# EAGLE design LIC_rack_BB-00 (EAGLE 7.2.0)
AUTHOR: M. Petrilak; VERSION: 00

## Sheet 1 of 4
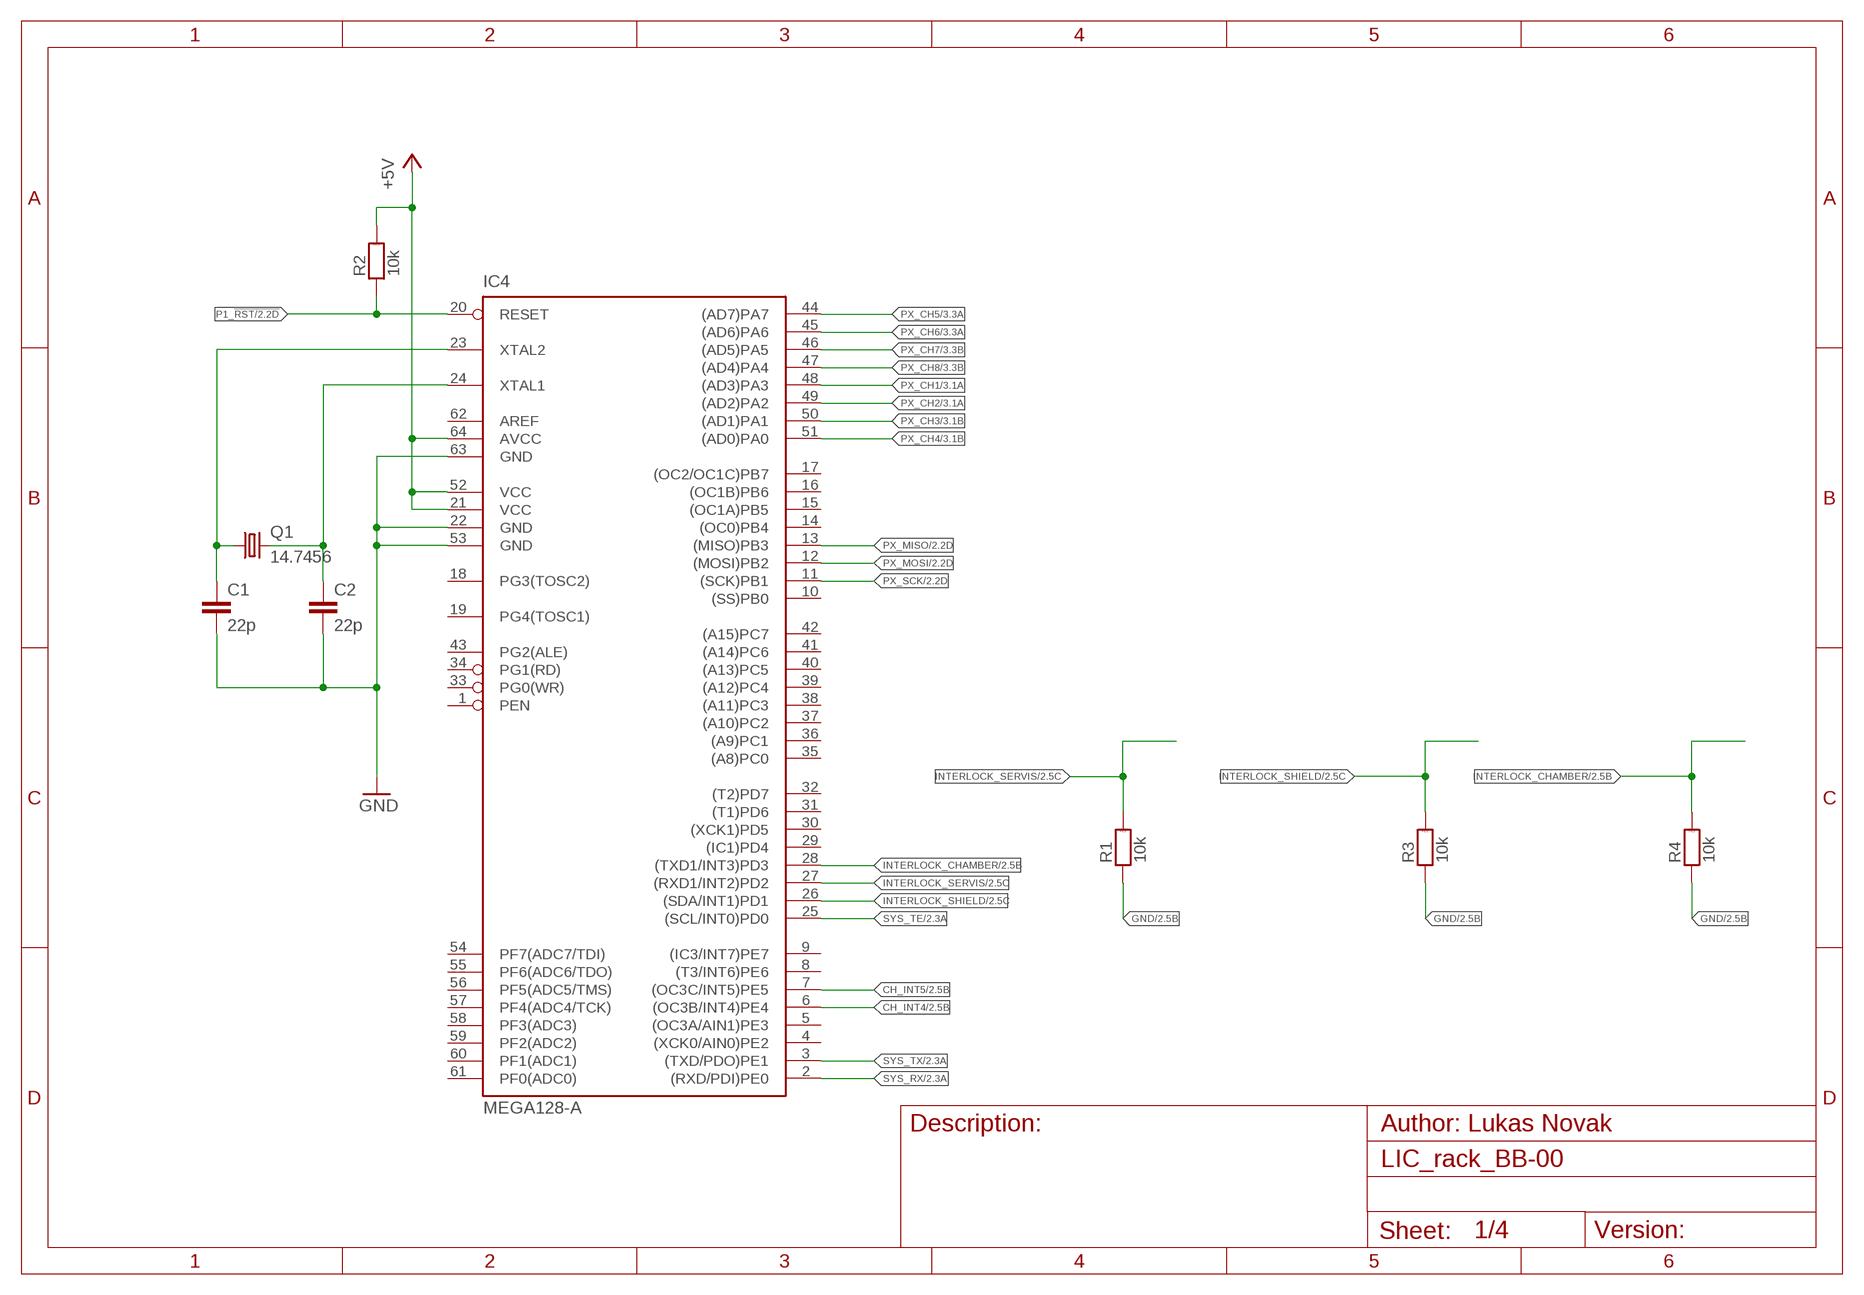
[diagram p0: schematic, sheet 1]

### Parts
C1  22p  C-EUC0805  [C0805]
C2  22p  C-EUC0805  [C0805]
IC4  MEGA128-A  [TQFP64]
Q1  14.7456  XTAL  [HC49U70]
R1  10k  R_1206  [1206]
R2  10k  R_1206  [1206]
R3  10k  R_1206  [1206]
R4  10k  R_1206  [1206]

### Nets
+5V: IC4.21(VCC) IC4.52(VCC) IC4.64(AVCC) R2.2 ; also sheet 2,3,4
CH_INT4: IC4.6((OC3B/INT4)PE4) ; also sheet 2,3
CH_INT5: IC4.7((OC3C/INT5)PE5) ; also sheet 2
CLK1: C1.1 IC4.23(XTAL2) Q1.1
GND: C1.2 C2.2 IC4.22(GND) IC4.53(GND) IC4.63(GND) R1.1 R3.1 R4.1 ; also sheet 2,3,4
INTERLOCK_CHAMBER: IC4.28((TXD1/INT3)PD3) R4.2 ; also sheet 2,3
INTERLOCK_SERVIS: IC4.27((RXD1/INT2)PD2) R1.2 ; also sheet 2
INTERLOCK_SHIELD: IC4.26((SDA/INT1)PD1) R3.2 ; also sheet 2
N$5: C2.1 IC4.24(XTAL1) Q1.2
P1_!RST: IC4.20(RESET) R2.1 ; also sheet 2
PX_CH1: IC4.48((AD3)PA3) ; also sheet 3
PX_CH2: IC4.49((AD2)PA2) ; also sheet 3
PX_CH3: IC4.50((AD1)PA1) ; also sheet 3
PX_CH4: IC4.51((AD0)PA0) ; also sheet 3
PX_CH5: IC4.44((AD7)PA7) ; also sheet 2,3
PX_CH6: IC4.45((AD6)PA6) ; also sheet 3
PX_CH7: IC4.46((AD5)PA5) ; also sheet 3
PX_CH8: IC4.47((AD4)PA4) ; also sheet 3
PX_MISO: IC4.13((MISO)PB3) ; also sheet 2
PX_MOSI: IC4.12((MOSI)PB2) ; also sheet 2
PX_SCK: IC4.11((SCK)PB1) ; also sheet 2
SYS_RX: IC4.2((RXD/PDI)PE0) ; also sheet 2
SYS_TE: IC4.25((SCL/INT0)PD0) ; also sheet 2
SYS_TX: IC4.3((TXD/PDO)PE1) ; also sheet 2
Unconnected: IC4.1(PEN) IC4.4((XCK0/AIN0)PE2) IC4.5((OC3A/AIN1)PE3) IC4.8((T3/INT6)PE6) IC4.9((IC3/INT7)PE7) IC4.10((SS)PB0) IC4.14((OC0)PB4) IC4.15((OC1A)PB5) IC4.16((OC1B)PB6) IC4.17((OC2/OC1C)PB7) IC4.18(PG3(TOSC2)) IC4.19(PG4(TOSC1)) IC4.29((IC1)PD4) IC4.30((XCK1)PD5) IC4.31((T1)PD6) IC4.32((T2)PD7) IC4.33(PG0(WR)) IC4.34(PG1(RD)) IC4.35((A8)PC0) IC4.36((A9)PC1) IC4.37((A10)PC2) IC4.38((A11)PC3) IC4.39((A12)PC4) IC4.40((A13)PC5) IC4.41((A14)PC6) IC4.42((A15)PC7) IC4.43(PG2(ALE)) IC4.54(PF7(ADC7/TDI)) IC4.55(PF6(ADC6/TDO)) IC4.56(PF5(ADC5/TMS)) IC4.57(PF4(ADC4/TCK)) IC4.58(PF3(ADC3)) IC4.59(PF2(ADC2)) IC4.60(PF1(ADC1)) IC4.61(PF0(ADC0)) IC4.62(AREF)

## Sheet 2 of 4
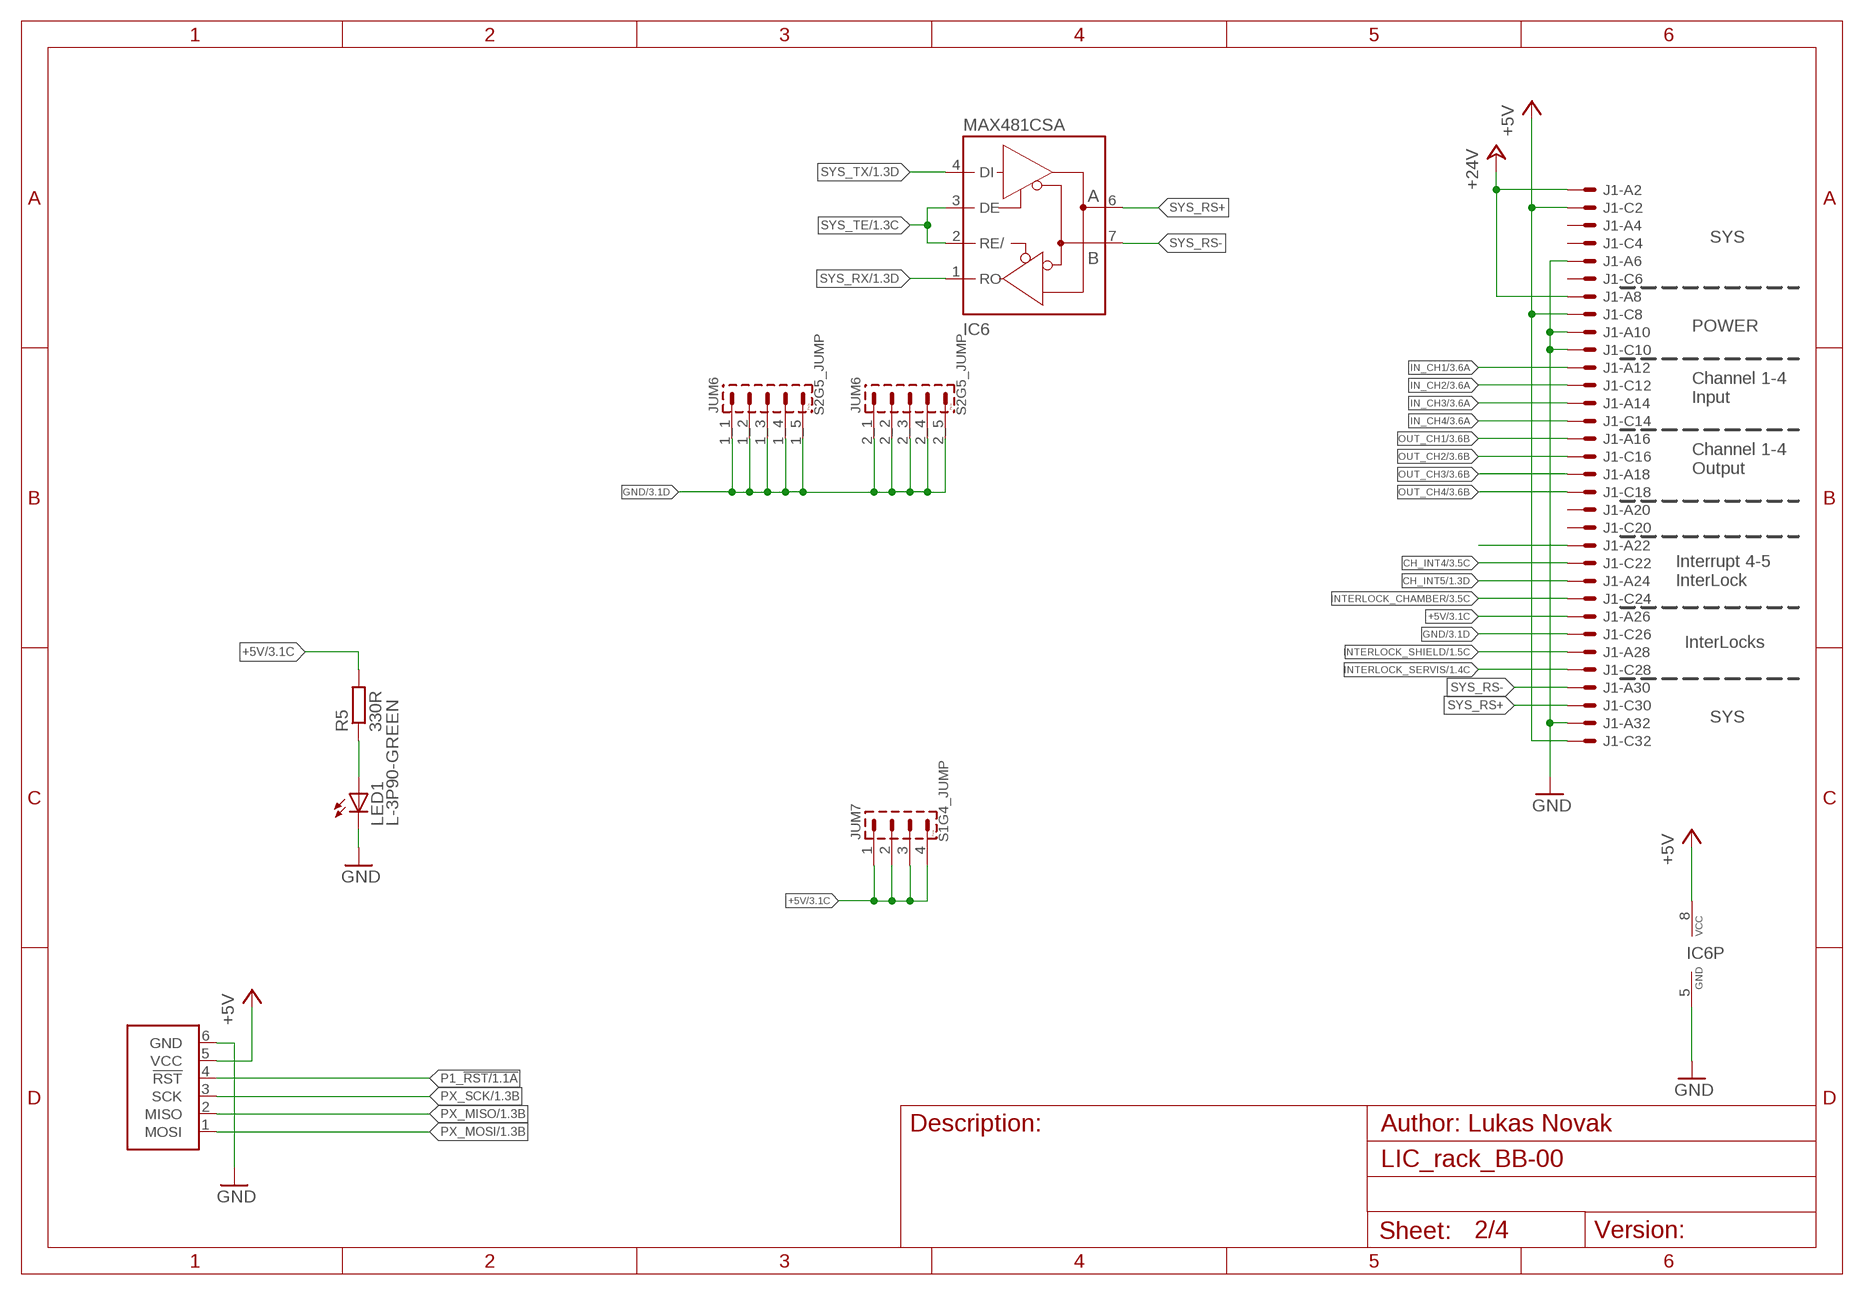
[diagram p1: schematic, sheet 2]

### Parts
IC6  MAX481CSA  [SO08]
J1  VG32SP  [VG32P]
JUM6  S2G5_JUMP  [S2G5_JUM]
JUM7  S1G4_JUMP  [S1G4_JUM]
LED1  L-3P90-GREEN  [L-3P90]
R5  330R  R-EU_R1206  [R1206]
U1  ATPROG-V  [6410-06]

### Nets
+5V: IC6.8(VCC) J1.A26 J1.C2 J1.C8 J1.C32 JUM7.1 JUM7.2 JUM7.3 JUM7.4 R5.2 U1.5(VCC) ; also sheet 1,3,4
+24V: J1.A2 J1.A8
CH_INT4: J1.C22 ; also sheet 1,3
CH_INT5: J1.A24 ; also sheet 1
GND: IC6.5(GND) J1.A6 J1.A10 J1.A32 J1.C10 J1.C26 JUM6.1_1 JUM6.1_2 JUM6.1_3 JUM6.1_4 JUM6.1_5 JUM6.2_1 JUM6.2_2 JUM6.2_3 JUM6.2_4 JUM6.2_5 LED1.K(C) U1.6(GND) ; also sheet 1,3,4
IN_CH1: J1.A12 ; also sheet 3
IN_CH2: J1.C12 ; also sheet 3
IN_CH3: J1.A14 ; also sheet 3
IN_CH4: J1.C14 ; also sheet 3
INTERLOCK_CHAMBER: J1.C24 ; also sheet 1,3
INTERLOCK_SERVIS: J1.C28 ; also sheet 1
INTERLOCK_SHIELD: J1.A28 ; also sheet 1
N$2: LED1.A R5.1
OUT_CH1: J1.A16 ; also sheet 3
OUT_CH2: J1.C16 ; also sheet 3
OUT_CH3: J1.A18 ; also sheet 3
OUT_CH4: J1.C18 ; also sheet 3
P1_!RST: U1.4(!RST) ; also sheet 1
PX_CH5: J1.A22 ; also sheet 1,3
PX_MISO: U1.2(MISO) ; also sheet 1
PX_MOSI: U1.1(MOSI) ; also sheet 1
PX_SCK: U1.3(SCK) ; also sheet 1
SYS_RS+: IC6.6(A) J1.C30
SYS_RS-: IC6.7(B) J1.A30
SYS_RX: IC6.1(RO) ; also sheet 1
SYS_TE: IC6.2(RE/) IC6.3(DE) ; also sheet 1
SYS_TX: IC6.4(DI) ; also sheet 1
Unconnected: J1.A4 J1.A20 J1.C4 J1.C6 J1.C20

### Notes on the sheet
- SYS
- POWER
- Channel 1-4
  Input
- Channel 1-4
  Output
- Interrupt 4-5
  InterLock
- InterLocks
- SYS

## Sheet 3 of 4
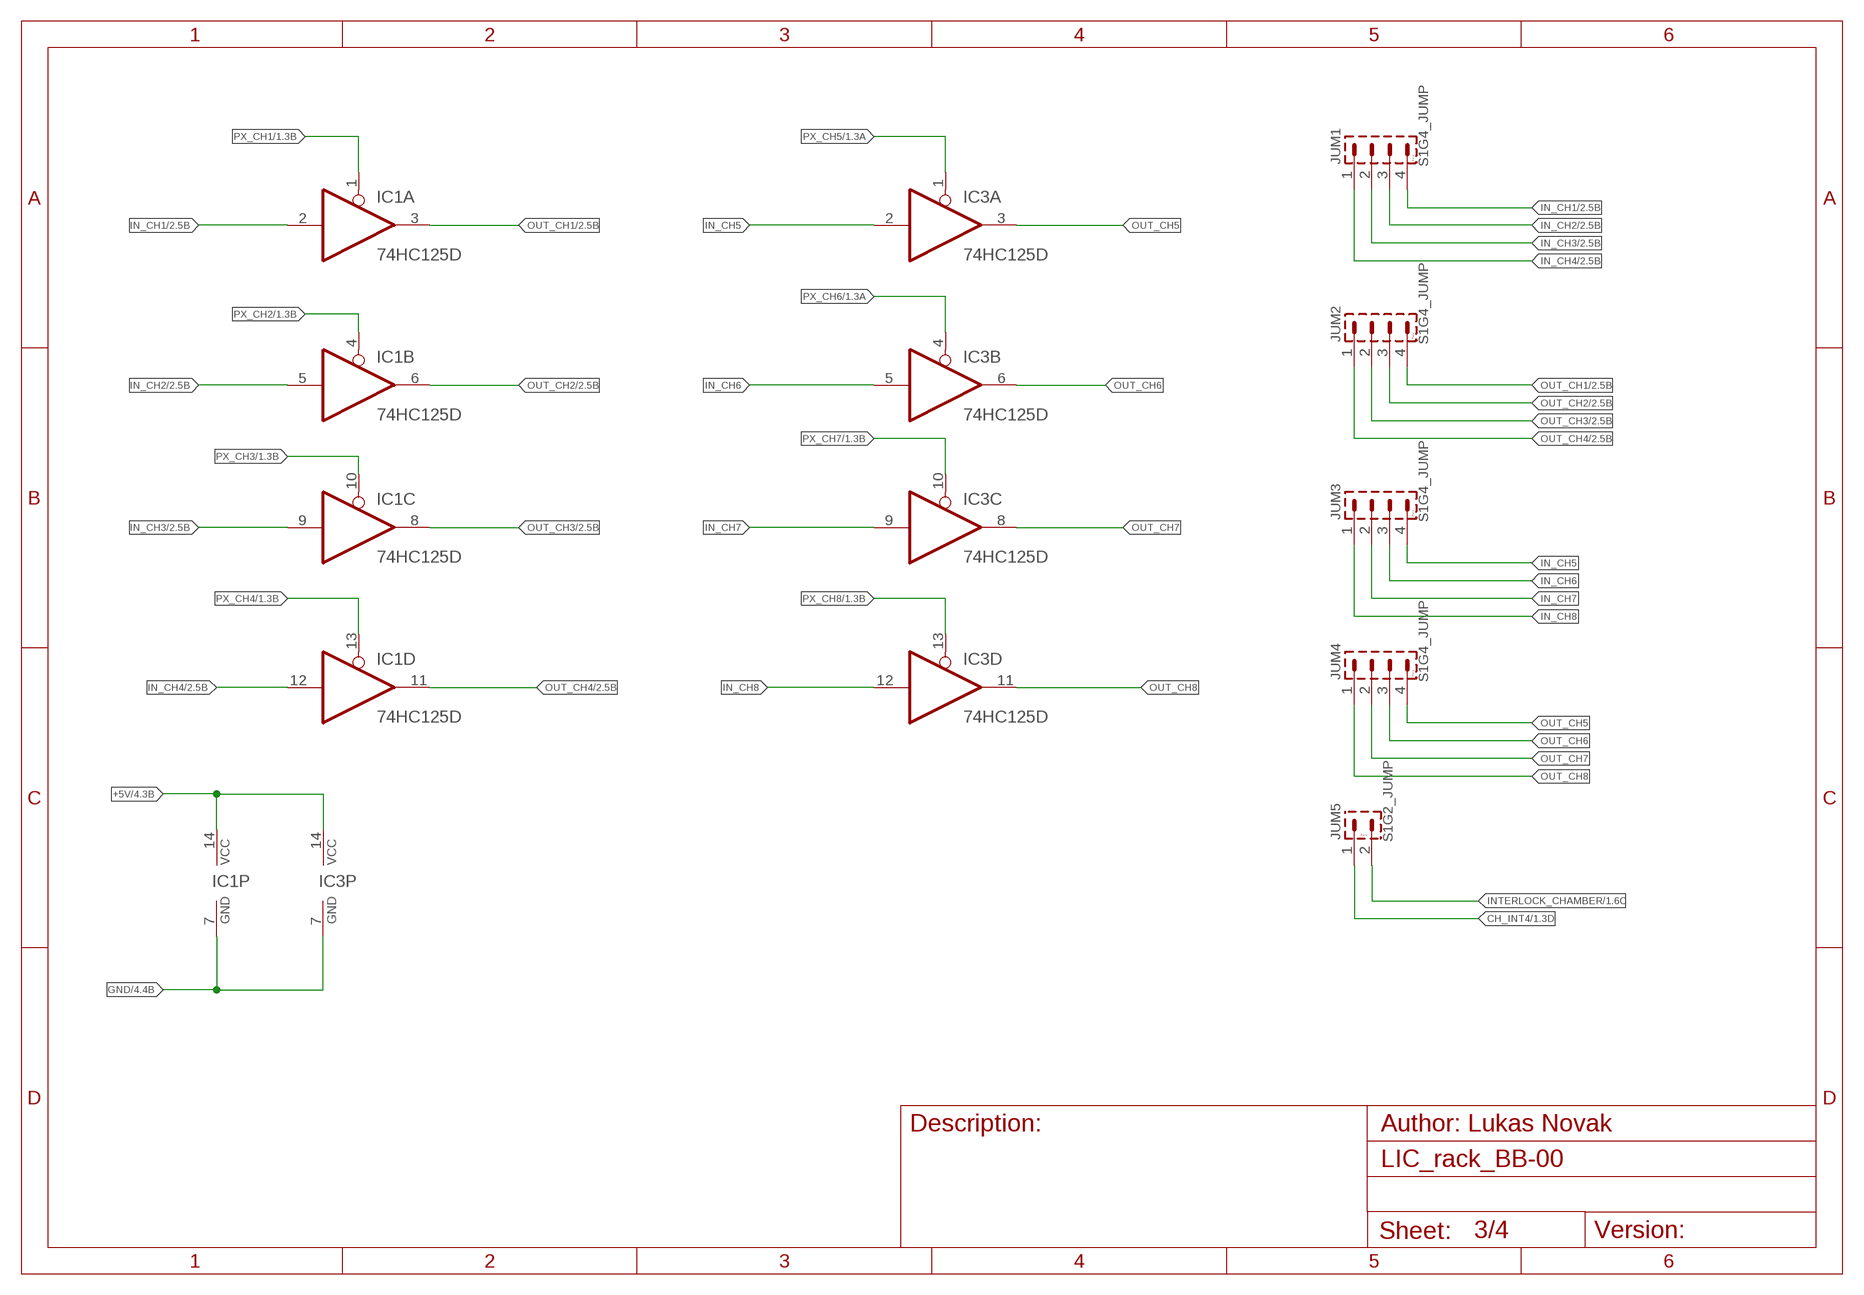
[diagram p2: schematic, sheet 3]

### Parts
IC1  74HC125D  [SO14]
IC3  74HC125D  [SO14]
JUM1  S1G4_JUMP  [S1G4_JUM]
JUM2  S1G4_JUMP  [S1G4_JUM]
JUM3  S1G4_JUMP  [S1G4_JUM]
JUM4  S1G4_JUMP  [S1G4_JUM]
JUM5  S1G2_JUMP  [S1G2_JUM]

### Nets
+5V: IC1.14(P:VCC) IC3.14(P:VCC) ; also sheet 1,2,4
CH_INT4: JUM5.1 ; also sheet 1,2
GND: IC1.7(P:GND) IC3.7(P:GND) ; also sheet 1,2,4
IN_CH1: IC1.2(A:I) JUM1.4 ; also sheet 2
IN_CH2: IC1.5(B:I) JUM1.3 ; also sheet 2
IN_CH3: IC1.9(C:I) JUM1.2 ; also sheet 2
IN_CH4: IC1.12(D:I) JUM1.1 ; also sheet 2
IN_CH5: IC3.2(A:I) JUM3.4
IN_CH6: IC3.5(B:I) JUM3.3
IN_CH7: IC3.9(C:I) JUM3.2
IN_CH8: IC3.12(D:I) JUM3.1
INTERLOCK_CHAMBER: JUM5.2 ; also sheet 1,2
OUT_CH1: IC1.3(A:O) JUM2.4 ; also sheet 2
OUT_CH2: IC1.6(B:O) JUM2.3 ; also sheet 2
OUT_CH3: IC1.8(C:O) JUM2.2 ; also sheet 2
OUT_CH4: IC1.11(D:O) JUM2.1 ; also sheet 2
OUT_CH5: IC3.3(A:O) JUM4.4
OUT_CH6: IC3.6(B:O) JUM4.3
OUT_CH7: IC3.8(C:O) JUM4.2
OUT_CH8: IC3.11(D:O) JUM4.1
PX_CH1: IC1.1(A:OE) ; also sheet 1
PX_CH2: IC1.4(B:OE) ; also sheet 1
PX_CH3: IC1.10(C:OE) ; also sheet 1
PX_CH4: IC1.13(D:OE) ; also sheet 1
PX_CH5: IC3.1(A:OE) ; also sheet 1,2
PX_CH6: IC3.4(B:OE) ; also sheet 1
PX_CH7: IC3.10(C:OE) ; also sheet 1
PX_CH8: IC3.13(D:OE) ; also sheet 1

## Sheet 4 of 4
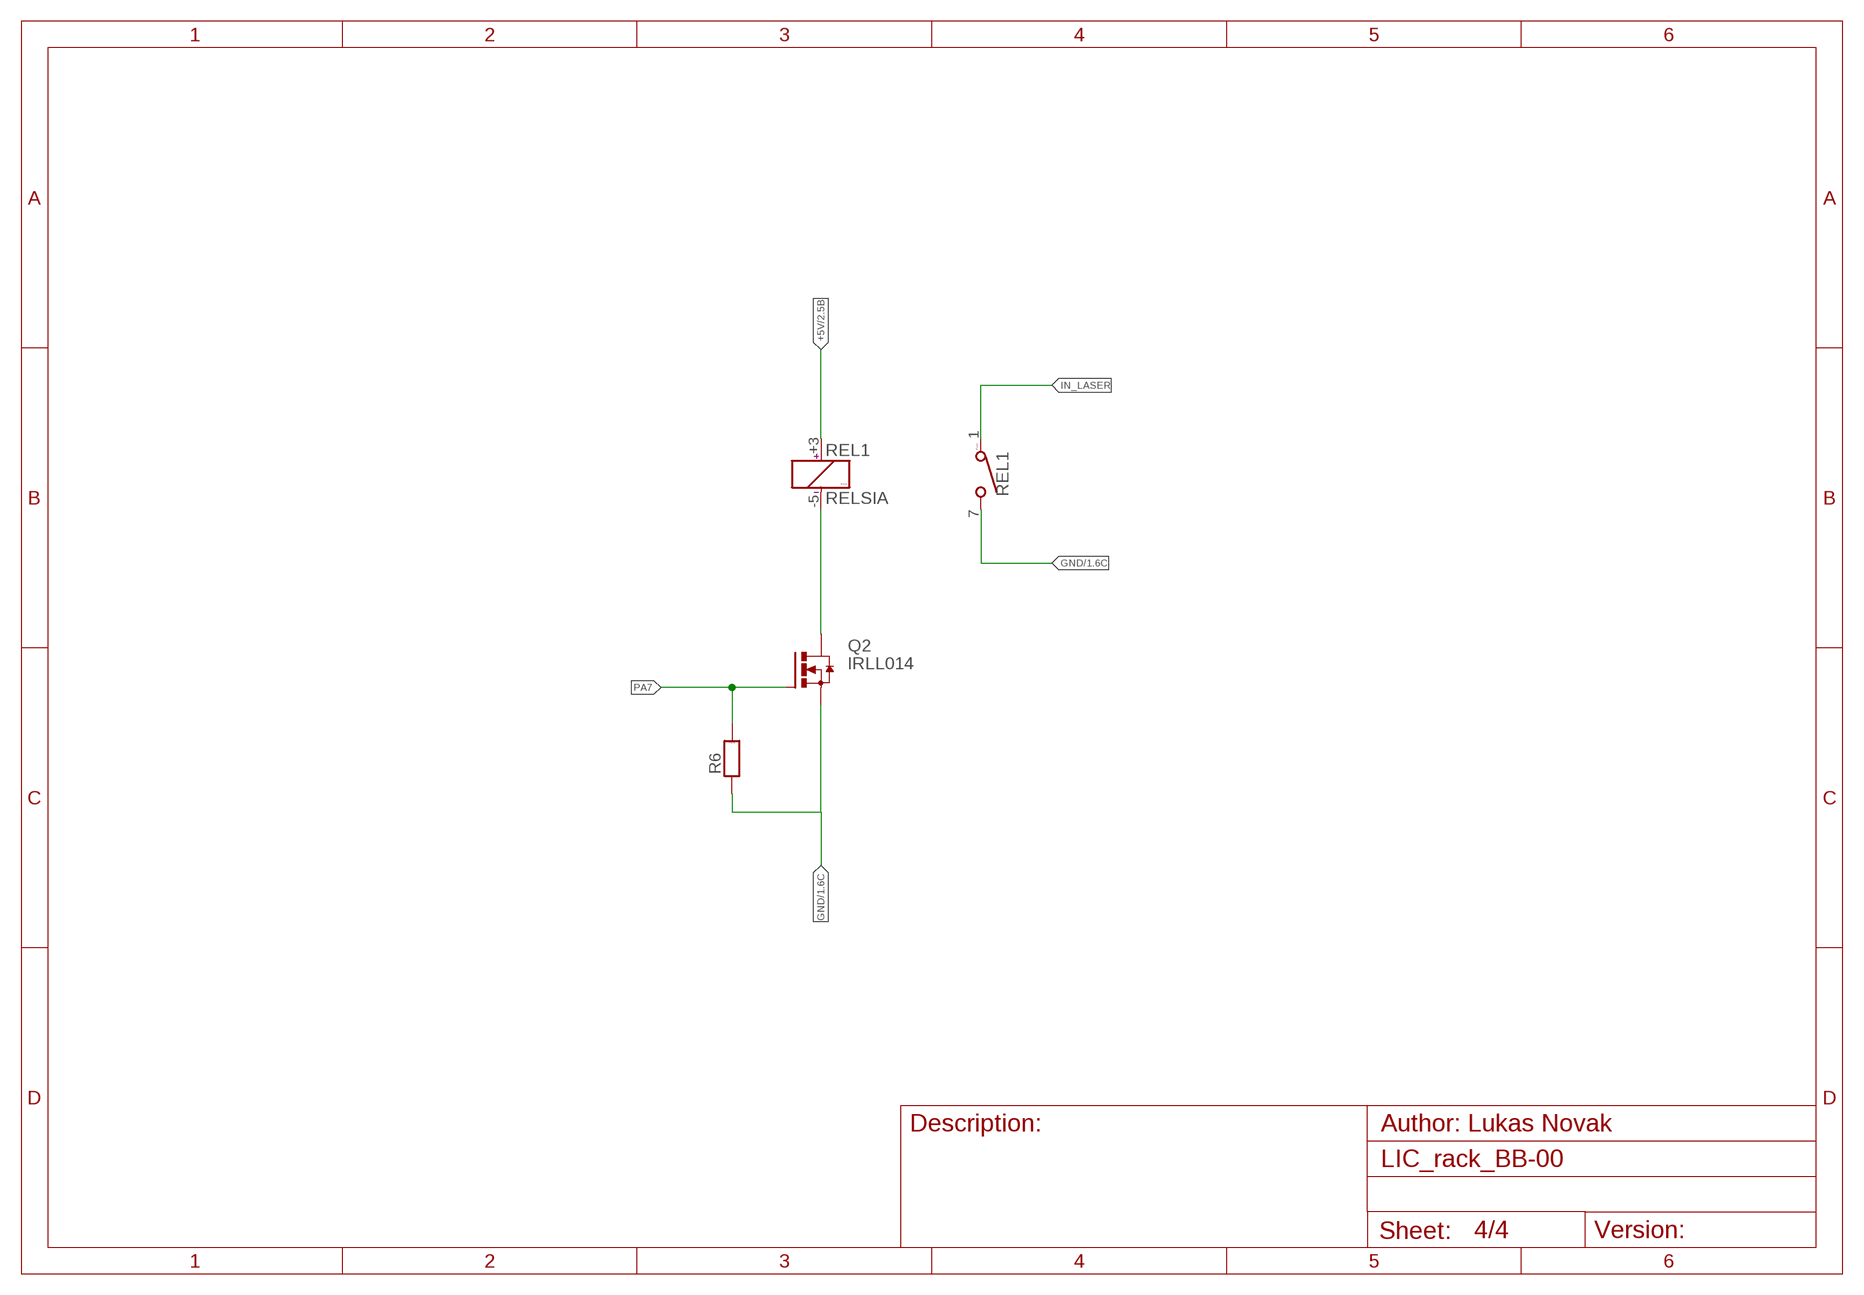
[diagram p3: schematic, sheet 4]

### Parts
Q2  IRLL014  N-HEXFET-2D_SOT232-  [SOT223]
R6  R_1206  [1206]
REL1  RELSIA  [RELSIA]

### Nets
+5V: REL1.+3(CIVKA:C+) ; also sheet 1,2,3
GND: Q2.3(S) R6.1 REL1.7 ; also sheet 1,2,3
IN_LASER: REL1.1
N$3: Q2.2(D) Q2.4(D) REL1.-5(CIVKA:C-)
PA7: Q2.1(G) R6.2

## Library data of the parts
C1 C2 = rcl:C-EU: CAPACITOR, European symbol
IC1 IC3 = 74xx-eu:74*125: Quad bus BUFFER, 3-state
IC4 = atmel:MEGA128: MICROCONTROLLER 128 Kbytes FLASH 4 Kbytes SRAM 4 Kbytes EEPROM DUAL USART 8-channel 10 bit ADC Source: avr.lbr; MPN: ATMEGA128-16AU; OC_FARNELL: 9171118; OC_NEWARK: 95K7364
IC6 = maxim:MAX481CSA: RS485 TRANSEIVER
J1 = 19inch:VG32S: PCB EUROCARD, 32-pin type C/AC, 5.08 mm
JUM1-JUM4 JUM7 = #PaJa_konektory:S1G4_JUMP: Radove konektory - koliky - 4x
JUM5 = #PaJa_konektory:S1G2_JUMP: Radove konektory - koliky - 2x
JUM6 = #PaJa_konektory:S2G5_JUMP: Radove konektory - koliky - dvojite - 2x5
LED1 = led:L-3P90
Q1 = crystal:XTAL
Q2 = transistor-power:N-HEXFET-2D_?-*: HEXFET® Power MOSFET 2 Drain connects http://www.irf.com/product-info/datasheets/data/irll014n.pdf
R1-R4 R6 = #PaJa_31:R: Rezistor
R5 = rcl:R-EU_: RESISTOR, European symbol
REL1 = #PaJa_31:RELSIA??: RELE - 1x spinaci, 5V, 12V, 24V max. spinany proud = 0,5A
U1 = con-molex:ATPROG

## Board
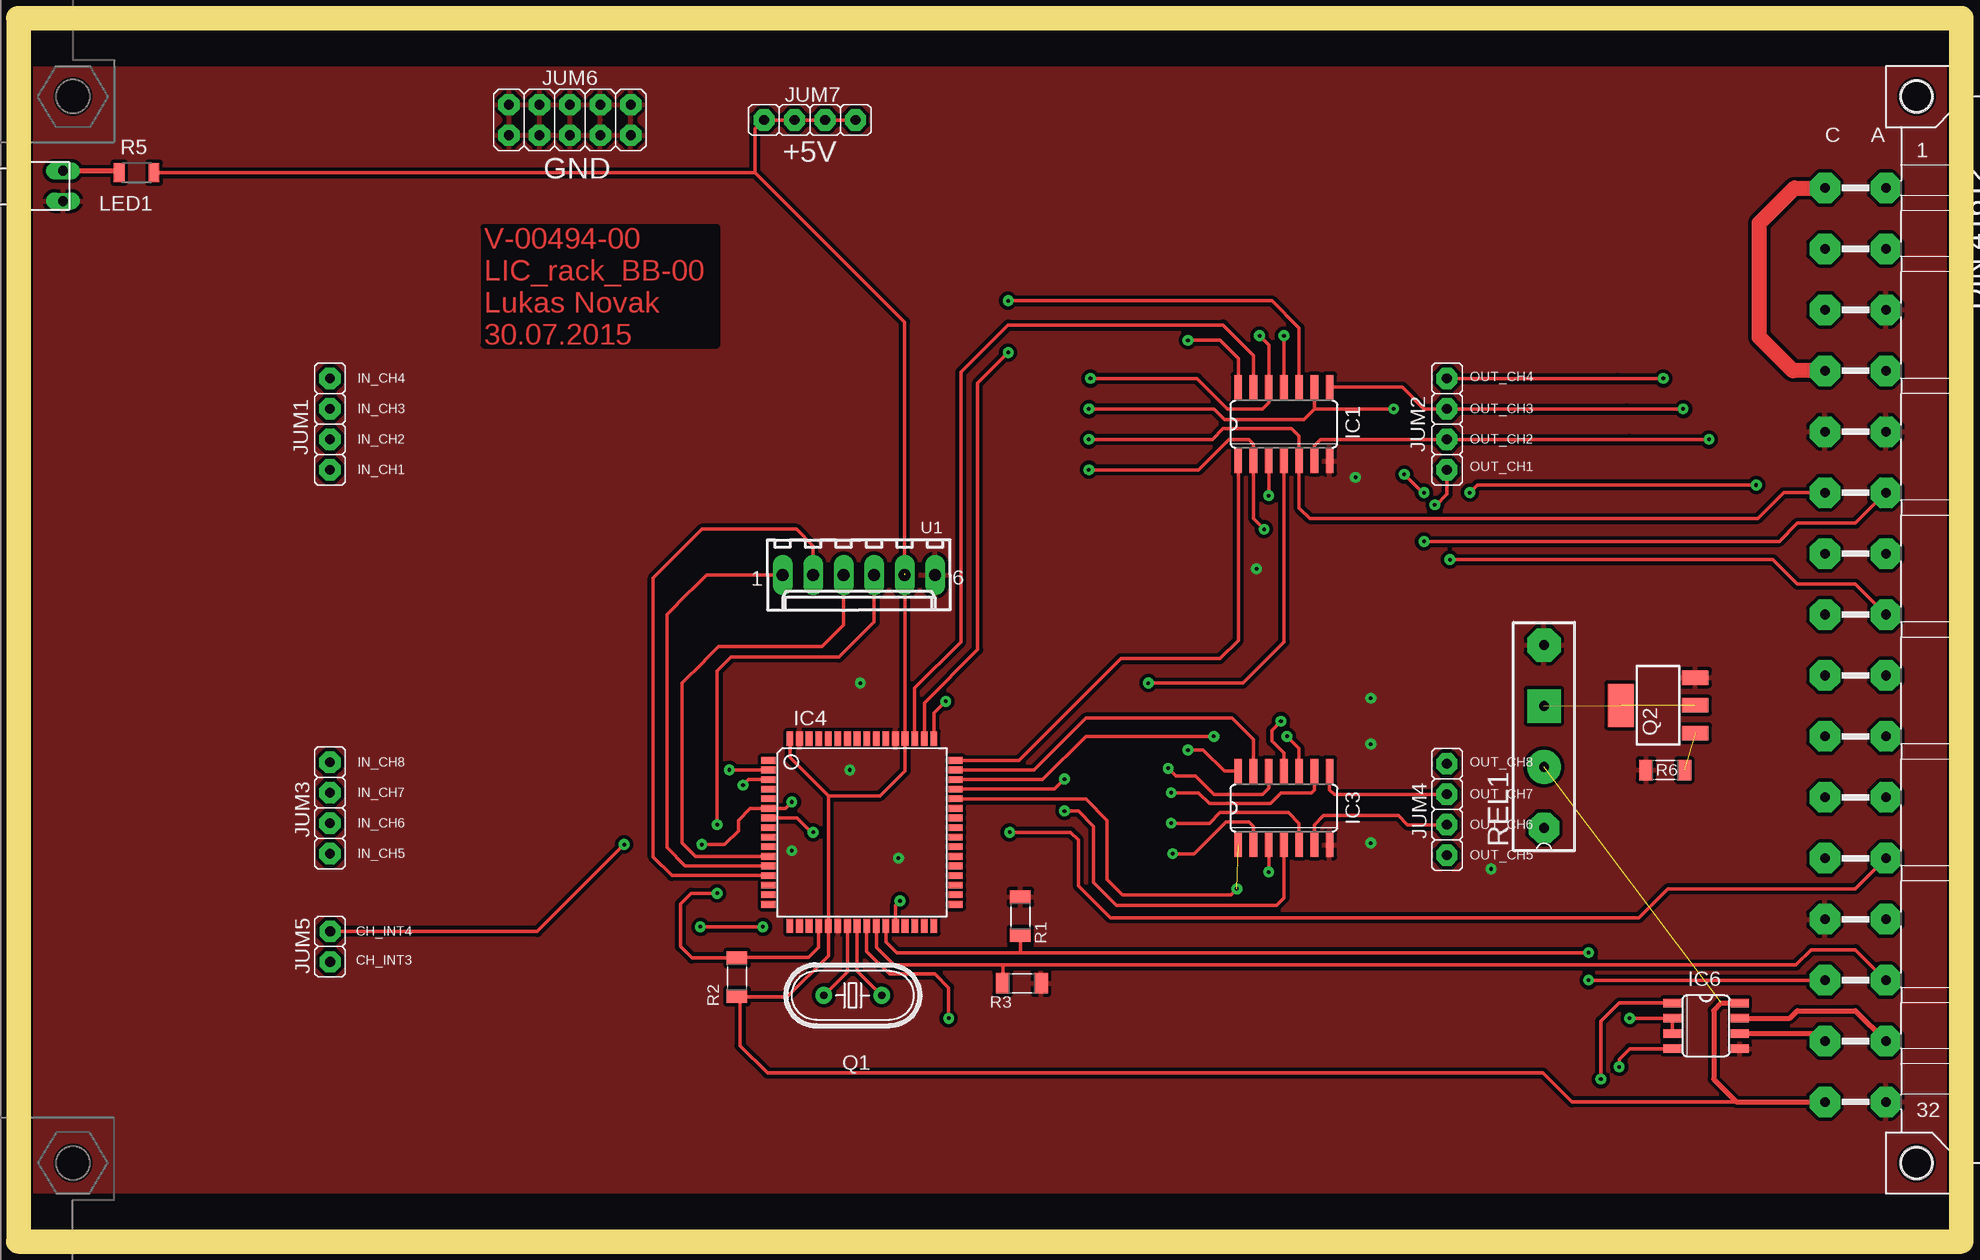
[diagram p4: board, top side]
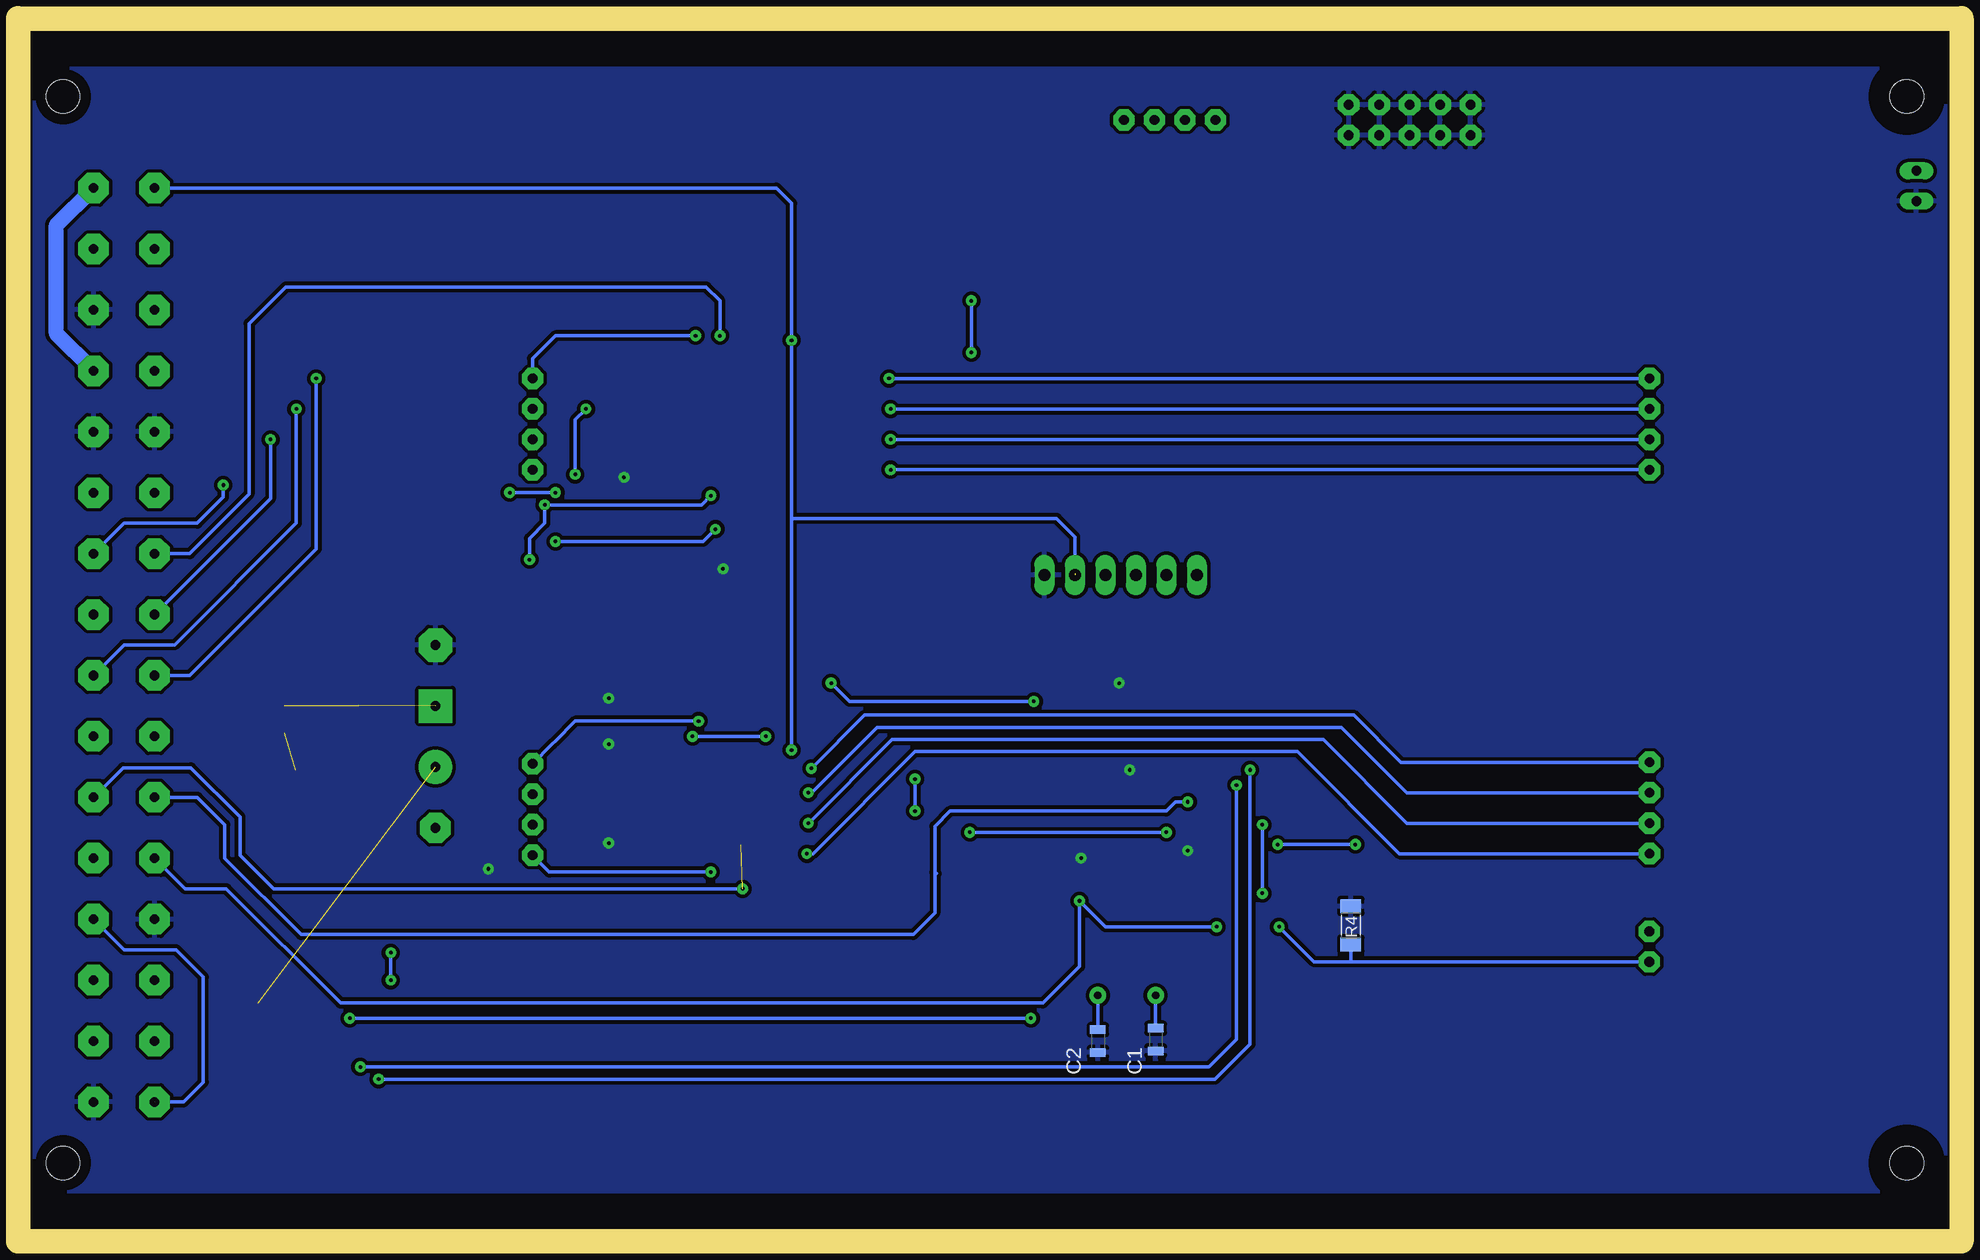
[diagram p5: board, bottom side, seen from below]

Size 160 x 100 mm. Coordinates in mm from the lower left corner, seen from the top.
Copper layers (1*16): Top 0.04mm / dielectric 1.5mm / Bottom 0.04mm
Design rules "mucha_navrh_my_fine": minimum track width 0.2mm, minimum drill 0.6mm, track to track 0.3mm, track to pad 0.3mm, pad to pad 0.3mm, via to via 0.3mm, smd to smd 0mil, copper to edge 0.2mm, drill to drill 0.2mm, minimum pad ring 0.3mm, minimum via ring 0.3mm, stop-mask expansion 0.1mm, vias tented up to drill 0.5mm, thermal gap 0.3mm

### Footprints (pad centres in the part's own frame; a part is rotated, then mirrored left to right if it is on the bottom)
C0805 = smd 0.7 x 1.3: 1 -0.95,0; 2 0.95,0
SO14 = smd 0.66 x 2.032: 1 -3.81,-3.073; 2 -2.54,-3.073; 3 -1.27,-3.073; 4 0,-3.073; 5 1.27,-3.073; 6 2.54,-3.073; 7 3.81,-3.073; 8 3.81,3.073; 9 2.54,3.073; 10 1.27,3.073; 11 0,3.073; 12 -1.27,3.073; 13 -2.54,3.073; 14 -3.81,3.073
TQFP64 = smd 1.194 x 0.559: 1 -7.8,6; 2 -7.8,5.2; 3 -7.8,4.4; 4 -7.8,3.6; 5 -7.8,2.8; 6 -7.8,2; 7 -7.8,1.2; 8 -7.8,0.4; 9 -7.8,-0.4; 10 -7.8,-1.2; 11 -7.8,-2; 12 -7.8,-2.8; 13 -7.8,-3.6; 14 -7.8,-4.4; 15 -7.8,-5.2; 16 -7.8,-6; 33 7.8,-6; 34 7.8,-5.2; 35 7.8,-4.4; 36 7.8,-3.6; 37 7.8,-2.8; 38 7.8,-2; 39 7.8,-1.2; 40 7.8,-0.4; 41 7.8,0.4; 42 7.8,1.2; 43 7.8,2; 44 7.8,2.8; 45 7.8,3.6; 46 7.8,4.4; 47 7.8,5.2; 48 7.8,6 | smd 0.559 x 1.194: 17 -6,-7.8; 18 -5.2,-7.8; 19 -4.4,-7.8; 20 -3.6,-7.8; 21 -2.8,-7.8; 22 -2,-7.8; 23 -1.2,-7.8; 24 -0.4,-7.8; 25 0.4,-7.8; 26 1.2,-7.8; 27 2,-7.8; 28 2.8,-7.8; 29 3.6,-7.8; 30 4.4,-7.8; 31 5.2,-7.8; 32 6,-7.8; 49 6,7.8; 50 5.2,7.8; 51 4.4,7.8; 52 3.6,7.8; 53 2.8,7.8; 54 2,7.8; 55 1.2,7.8; 56 0.4,7.8; 57 -0.4,7.8; 58 -1.2,7.8; 59 -2,7.8; 60 -2.8,7.8; 61 -3.6,7.8; 62 -4.4,7.8; 63 -5.2,7.8; 64 -6,7.8
SO08 = smd 0.72 x 1.5: 1 -1.905,-2.8; 2 -0.635,-2.8; 3 0.635,-2.8; 4 1.905,-2.8; 5 1.905,2.8; 6 0.635,2.8; 7 -0.635,2.8; 8 -1.905,2.8
VG32P = drill 0.8 pad 2.54 octagon: A2 154.7,36.83; A4 154.7,31.75; A6 154.7,26.67; A8 154.7,21.59; A10 154.7,16.51; A12 154.7,11.43; A14 154.7,6.35; A16 154.7,1.27; A18 154.7,-3.81; A20 154.7,-8.89; A22 154.7,-13.97; A24 154.7,-19.05; A26 154.7,-24.13; A28 154.7,-29.21; A30 154.7,-34.29; A32 154.7,-39.37; C2 149.62,36.83; C4 149.62,31.75; C6 149.62,26.67; C8 149.62,21.59; C10 149.62,16.51; C12 149.62,11.43; C14 149.62,6.35; C16 149.62,1.27; C18 149.62,-3.81; C20 149.62,-8.89; C22 149.62,-13.97; C24 149.62,-19.05; C26 149.62,-24.13; C28 149.62,-29.21; C30 149.62,-34.29; C32 149.62,-39.37 | hole 2.794: 3.57,44.45; 3.57,-44.45; 157.24,44.45; 157.24,-44.45; 3.57,44.45; 3.57,-44.45; 157.24,44.45; 157.24,-44.45
S1G4_JUM = drill 0.813 pad 1.778 octagon: 1 -3.81,0; 2 -1.27,0; 3 1.27,0; 4 3.81,0
S1G2_JUM = drill 0.813 pad 1.778 octagon: 1 -1.27,0; 2 1.27,0
S2G5_JUM = drill 0.813 pad 1.778 octagon: 1_1 -5.08,-1.27; 1_2 -2.54,-1.27; 1_3 0,-1.27; 1_4 2.54,-1.27; 1_5 5.08,-1.27; 2_1 -5.08,1.27; 2_2 -2.54,1.27; 2_3 0,1.27; 2_4 2.54,1.27; 2_5 5.08,1.27
L-3P90 = drill 0.813 long: A 4.7,1.27; K 4.7,-1.27
HC49U70 = drill 0.6 pad 1.4: 1 -2.413,0; 2 2.413,0
SOT223 = smd 1.219 x 2.235: 1 -2.311,-3.099; 2 0,-3.099; 3 2.311,-3.099 | smd 3.6 x 2.2: 4 0,3.099
1206 = smd 1.143 x 1.702: 1 -1.587,0; 2 1.587,0
R1206 = smd 0.9 x 1.6: 1 -1.45,0; 2 1.45,0
RELSIA = drill 0.813 pad 2.54 octagon: 1 -7.62,0 | drill 0.813 pad 2.8 octagon: 7 7.62,0 | drill 0.813 pad 2.8: +3 -2.54,0 | drill 0.813 pad 2.8 square: -5 2.54,0
6410-06 = drill 1.016 long: 1 6.35,0; 2 3.81,0; 3 1.27,0; 4 -1.27,0; 5 -3.81,0; 6 -6.35,0

### Placement (x,y rotation side)
C1  66.17,15.84 270 bottom
C2  70.99,15.71 270 bottom
IC1  104.52,67.14 0 top
IC3  104.52,35.14 0 top
IC4  69.34,33.11 0 top
IC6  139.7,16.98 270 top
J1  0,50 0 top
JUM1  25,67.14 270 top
JUM2  118.11,67.14 270 top
JUM3  25,35.14 270 top
JUM4  118.11,35.01 270 top
JUM5  25.02,23.58 270 top
JUM6  45,92.5 0 top
JUM7  65,92.5 0 top
LED1  -1.94,87 0 top
Q1  68.58,19.52 0 top
Q2  135.7,43.7 90 top
R1  82.55,26.12 270 top
R2  58.93,21.04 270 top
R3  82.68,20.54 180 top
R4  49.91,25.36 270 bottom
R5  8.89,88.1 0 top
R6  136.3,38.3 0 top
REL1  RELSIA?  [RELSIA]  126.2,41.1 90 top
U1  69.09,54.57 180 top

### Tracks (layer width: path | path; a pad name or v marks a point on that pad's centre or on a via)
+5V  (via drill 0.3)  (3 unrouted)
  Top 0.305: 59.18,19.39 63.12,19.39 66.54,22.82 IC4.21 66.54,36.16 | 59.18,19.39 58.99,19.39 R2.2 | IC4.64 63.34,39.36 66.54,36.16 | 66.54,36.16 70.87,36.16 72.94,38.23 IC4.52 72.94,54.53 U1.5 | IC3.14 99.54,38.21 97.79,39.97 v96.52,39.97 | 59.18,19.39 59.18,15.33 61.47,13.04 126.11,13.04 128.52,10.63 142.37,10.63 | v96.52,74.13 99.19,74.13 100.71,72.61 IC1.14 | R5.2 60.45,88.1 | 60.45,88.1 72.9,75.65 72.9,54.7 | 60.45,88.1 60.45,91.76 JUM7.1 JUM7.2 JUM7.3 JUM7.4
  Top 0.406: J1.C32 142.37,10.63 142.24,10.63 140.34,12.53 140.34,18.25 140.97,18.89 IC6.8
  Top 1.27: J1.C8 146.94,71.59 144.15,74.38 144.15,83.91 147.07,86.83 J1.C2
  Bottom 0.305: 149.61,10.63 147.19,10.63 145.54,12.28 145.54,21.04 147.83,23.33 152.16,23.33 J1.A26 | v96.52,39.97 96.52,59.27 | 96.52,59.27 v96.52,74.13 96.52,85.56 97.79,86.83 J1.C2 | U1.5 72.9,57.75 74.42,59.27 96.52,59.27
+24V
  Bottom 1.27: J1.A2 157.8,83.73 157.8,74.69 J1.A8
CH_INT4  (via drill 0.3)
  Top 0.305: v56.01,32.09 57.91,32.09 59.05,33.24 59.05,34.12 60.04,35.11 IC4.6 62.96,35.11 v63.5,35.65 | v49.53,32.09 42.29,24.85 JUM5.1
  Bottom 0.305: 84.58,29.81 84.58,33.62 83.31,34.89 65.28,34.89 64.52,35.65 v63.5,35.65 | 84.58,29.81 84.58,26.38 86.36,24.6 137.41,24.6 143.76,30.95 143.76,33.74 146.05,36.03 J1.C22 | 84.45,29.68 84.58,29.81 | v56.01,32.09 v49.53,32.09
CH_INT5  (via drill 0.3)
  Top 0.305: J1.A24 154.69,30.95 152.15,28.41 136.53,28.41 134.11,26 90.04,26 87.38,28.66 87.38,32.47 86.74,33.11 v81.66,33.11 | v65.28,33.11 65.15,33.11 63.95,34.31 IC4.7
  Bottom 0.305: v81.66,33.11 v65.28,33.11
CLK1
  Top 0.305: IC4.23 68.14,21.5 Q1.1
  Bottom 0.305: Q1.1 C1.1
GND  (via drill 0.3)
  other vias: 69.22,45.55 63.5,31.59 72.39,30.95 68.33,38.32 121.79,30.06 111.76,32.22 111.76,44.28 111.76,40.48 110.49,62.7 102.23,55.08
  pour Bottom: 0,-0.8 160.02,-0.8 160.02,99.53 0,99.53
  pour Top: 0,0.47 160.02,0.47 160.02,99.53 0,99.53
IN_CH1  (via drill 0.3)
  Top 0.305: v102.87,58.38 101.98,59.27 IC1.2 101.98,65.49 101.6,65.88 99.95,65.88 97.41,63.33 v88.27,63.33 v88.27,63.34 | v116.2,57.37 145.8,57.37 147.32,58.89 152.16,58.89 J1.A12
  Bottom 0.305: v102.87,58.38 103.89,57.37 v116.2,57.37 | v88.27,63.34 JUM1.4
IN_CH2  (via drill 0.3)
  Top 0.305: J1.C12 146.18,61.43 144.02,59.27 106.68,59.27 105.79,60.16 IC1.5 105.79,66.13 105.16,66.76 99.44,66.76 98.55,65.87 v88.27,65.87 v88.27,65.88
  Bottom 0.305: v88.27,65.88 JUM1.3
IN_CH3  (via drill 0.3)
  Top 0.305: 107.06,68.41 106.17,67.53 99.57,67.53 98.68,68.41 v88.27,68.41 | 107.06,68.41 IC1.9 | 107.06,68.41 v113.67,68.41 | v143.89,62.06 120.65,62.06 v120.02,61.43 | v116.2,61.43 116.08,61.43 v114.55,62.95
  Bottom 0.305: v143.89,62.06 143.89,61.05 146.05,58.89 152.16,58.89 J1.A14 | v88.27,68.41 JUM1.2 | v120.02,61.43 v116.2,61.43 | v114.55,62.95 114.55,67.53 v113.67,68.41
IN_CH4  (via drill 0.3)
  Top 0.305: v102.49,74.51 103.25,73.75 IC1.12 103.25,68.92 102.74,68.41 99.82,68.41 97.29,70.95 v88.4,70.95 v88.39,70.95
  Bottom 0.305: v102.49,74.51 102.49,77.43 103.63,78.58 138.68,78.58 141.73,75.53 141.73,61.3 146.69,56.35 J1.C14 | JUM1.1 v88.39,70.95
IN_CH5  (via drill 0.3)
  Top 0.305: IC3.2 101.98,33.62 101.6,34 99.69,34 97.03,31.33 v95.25,31.33
  Bottom 0.305: v95.25,31.33 94.74,31.33 86.23,39.84 54.36,39.84 45.85,31.33 JUM3.4
IN_CH6  (via drill 0.3)
  Top 0.305: IC3.5 105.79,33.87 104.9,34.76 99.19,34.76 98.3,33.87 v95.12,33.87
  Bottom 0.305: v95.12,33.87 88.14,40.86 52.2,40.86 45.21,33.87 JUM3.3
IN_CH7  (via drill 0.3)
  Top 0.305: IC3.9 107.06,36.66 106.81,36.41 104.27,36.41 103.38,35.52 98.3,35.52 97.41,36.41 v95.12,36.41
  Bottom 0.305: v95.12,36.41 94.87,36.41 89.41,41.87 50.67,41.87 45.21,36.41 JUM3.2
IN_CH8  (via drill 0.3)
  Top 0.305: IC3.12 103.25,36.79 102.74,36.28 98.68,36.28 97.16,37.81 95.5,37.81 v94.87,38.44
  Bottom 0.305: v94.87,38.44 90.42,42.89 49.66,42.89 45.72,38.95 JUM3.1
INTERLOCK_CHAMBER  (via drill 0.3)
  Top 0.305: IC4.28 72.14,27.02 v72.52,27.39 | v55.88,25.23 v61.09,25.23
  Bottom 0.305: JUM5.2 50.04,22.31 | 50.04,22.31 52.96,22.31 v55.88,25.23 | v61.09,25.23 70.36,25.23 v72.52,27.39 72.52,21.93 75.56,18.89 134.11,18.89 143.64,28.41 147.08,28.41 J1.C24 | R4.2 49.91,22.44 50.04,22.31
INTERLOCK_SERVIS  (via drill 0.3)
  Top 0.305: IC4.27 71.34,24 72.26,23.08 82.55,23.08 | J1.C28 v129.92,20.79 | v129.92,23.08 82.55,23.08 | R1.2 82.55,23.08
  Bottom 0.305: v129.92,20.79 v129.92,23.08
INTERLOCK_SHIELD
  Top 0.305: IC4.26 70.54,23.53 72.01,22.06 81.03,22.06 | 81.03,22.06 147.19,22.06 148.46,23.33 152.16,23.33 J1.A28 | R3.2 81.09,22 81.03,22.06
N$2
  Top 0.406: LED1.A 7.27,88.27 R5.1
N$3  (2 unrouted)
N$5
  Top 0.305: IC4.24 68.94,21.57 Q1.2
  Bottom 0.305: C2.1 Q1.2
OUT_CH1  (via drill 0.3)
  Top 0.305: JUM2.4 118.11,61.3 117.22,60.41 v117.09,60.41 | v103.25,61.18 IC1.3 | v118.36,55.84 145.29,55.84 147.32,53.81 152.16,53.81 J1.A16
  Bottom 0.305: v118.36,55.84 118.36,57.62 117.09,58.89 v117.09,60.41 104.01,60.41 v103.25,61.18
OUT_CH2  (via drill 0.3)
  Top 0.305: IC1.6 107.06,65.37 107.56,65.87 JUM2.3 133.35,65.87 133.35,65.88 v139.95,65.88
  Bottom 0.305: v139.95,65.88 139.95,60.94 J1.C16
OUT_CH3  (via drill 0.3)
  Top 0.305: IC1.8 114.41,70.21 116.2,68.41 JUM2.2 133.09,68.41 133.1,68.41 v137.79,68.41
  Bottom 0.305: v137.79,68.41 137.79,58.89 147.96,48.73 152.16,48.73 J1.A18
OUT_CH4  (via drill 0.3)
  Top 0.305: IC1.11 v104.52,74.51 | JUM2.1 132.33,70.95 v136.14,70.95
  Bottom 0.305: v104.52,74.51 116.2,74.51 118.11,72.61 JUM2.1 | v136.14,70.95 136.14,56.73 146.69,46.19 J1.C18
OUT_CH5  (via drill 0.3)
  Top 0.305: IC3.3 v103.25,29.81
  Bottom 0.305: v103.25,29.81 116.71,29.81 JUM4.4
OUT_CH6
  Top 0.305: IC3.6 107.06,33.74 107.82,34.51 114.05,34.51 114.81,33.74 JUM4.3
OUT_CH7
  Top 0.305: IC3.8 108.33,36.66 108.71,36.28 JUM4.2
OUT_CH8  (via drill 0.3)
  Top 0.305: IC3.11 104.52,39.71 103.5,40.73 103.5,41.62 v104.27,42.38
  Bottom 0.305: JUM4.1 116.46,40.48 116.2,40.73 114.55,42.38 v104.27,42.38
P1_!RST  (via drill 0.3)
  Top 0.305: IC4.20 65.74,23.54 64.9,22.7 58.99,22.7 R2.1 55.18,22.63 54.23,23.58 54.23,27.14 55.12,28.03 v57.28,28.03 | U1.4 70.36,50.63 67.44,47.71 58.42,47.71 57.28,46.57 v57.28,33.74
  Bottom 0.305: v57.28,33.74 v57.28,28.03
PA7  (1 unrouted)
PX_CH1
  Top 0.305: IC4.48 82.45,39.11 90.93,47.59 99.19,47.59 100.71,49.11 IC1.1
PX_CH2  (via drill 0.3)
  Top 0.305: IC4.49 75.34,43.05 v76.33,44.03 | IC1.4 104.52,48.98 101.09,45.55 v93.22,45.55
  Bottom 0.305: v76.33,44.03 91.69,44.03 v93.22,45.55
PX_CH3  (via drill 0.3)
  Top 0.305: IC4.50 74.54,43.9 78.99,48.35 78.99,70.57 v81.53,73.11 | v81.53,77.43 103.5,77.43 105.79,75.15 IC1.10
  Bottom 0.305: v81.53,73.11 v81.53,77.43
PX_CH4
  Top 0.305: IC4.51 73.74,45.13 77.6,48.98 77.6,71.46 81.53,75.4 99.44,75.4 101.98,72.86 IC1.13
PX_CH5  (via drill 0.3)  (1 unrouted)
  Top 0.305: IC4.44 88,35.91 89.79,34.12 89.79,29.17 91.06,27.9 100.1,27.9 v100.6,28.4
  Bottom 0.305: v100.6,28.4 139.7,28.4 142.5,31.2 142.5,34.4 146.6,38.5 152.23,38.5 J1.A22
PX_CH6  (via drill 0.3)
  Top 0.305: v86.23,34.89 87.38,34.89 88.65,33.62 88.65,28.92 90.55,27.01 103.89,27.01 104.52,27.65 IC3.4 | IC4.45 85.39,36.71 v86.23,37.55
  Bottom 0.305: v86.23,37.55 v86.23,34.89
PX_CH7  (via drill 0.3)
  Top 0.305: IC4.46 84.41,37.51 88.01,41.11 v98.68,41.11 | v104.78,41.11 105.79,40.09 IC3.10
  Bottom 0.305: v104.78,41.11 v98.68,41.11
PX_CH8
  Top 0.305: IC4.47 83.69,38.31 88.01,42.63 100.2,42.63 101.98,40.86 IC3.13
PX_MISO
  Top 0.305: U1.2 65.28,56.98 63.88,58.38 56.01,58.38 51.94,54.32 51.94,31.08 53.51,29.51 IC4.13
PX_MOSI
  Top 0.305: IC4.12 54.62,30.31 53.09,31.84 53.09,51.27 54.86,53.05 55.31,53.49 56.39,54.57 U1.1
PX_SCK
  Top 0.305: U1.3 67.82,50.38 66.04,48.6 57.4,48.6 56.33,47.52 56.13,47.33 54.36,45.55 54.36,32.22 55.47,31.11 IC4.11
SYS_RS+
  Top 0.406: IC6.6 148.99,16.34 J1.C30
SYS_RS-
  Top 0.406: IC6.7 146.69,17.62 147.32,18.25 152.16,18.25 J1.A30
SYS_RX  (via drill 0.3)
  Top 0.305: IC4.2 58.3,38.31 v58.29,38.32 | v130.94,12.53 130.94,17.36 132.46,18.89 IC6.1
  Bottom 0.305: v58.29,38.32 58.29,15.46 61.21,12.53 v130.94,12.53
SYS_TE  (via drill 0.3)
  Top 0.305: IC6.3 IC6.2 v133.35,17.62 | IC4.25 69.74,23.18 71.63,21.3 75.44,21.3 76.58,20.16 v76.58,17.62
  Bottom 0.305: v133.35,17.62 v76.58,17.62
SYS_TX  (via drill 0.3)
  Top 0.305: v132.46,13.55 132.46,14.19 133.35,15.08 IC6.4 | IC4.3 59.9,37.51 v59.44,37.05
  Bottom 0.305: v132.46,13.55 61.72,13.55 59.44,15.84 v59.44,37.05

### Text on the board
Top: V-00494-00 / LIC_rack_BB-00 / Lukas Novak / 30.07.2015
tNames: +5V | GND | IN_CH4 | OUT_CH4 | IN_CH3 | OUT_CH3 | IN_CH2 | OUT_CH2 | IN_CH1 | OUT_CH1 | IN_CH8 | OUT_CH8 | IN_CH7 | OUT_CH7 | IN_CH6 | OUT_CH6 | IN_CH5 | OUT_CH5 | CH_INT4 | CH_INT3